# Altium schematic sheet LEDs.SchDoc
size A
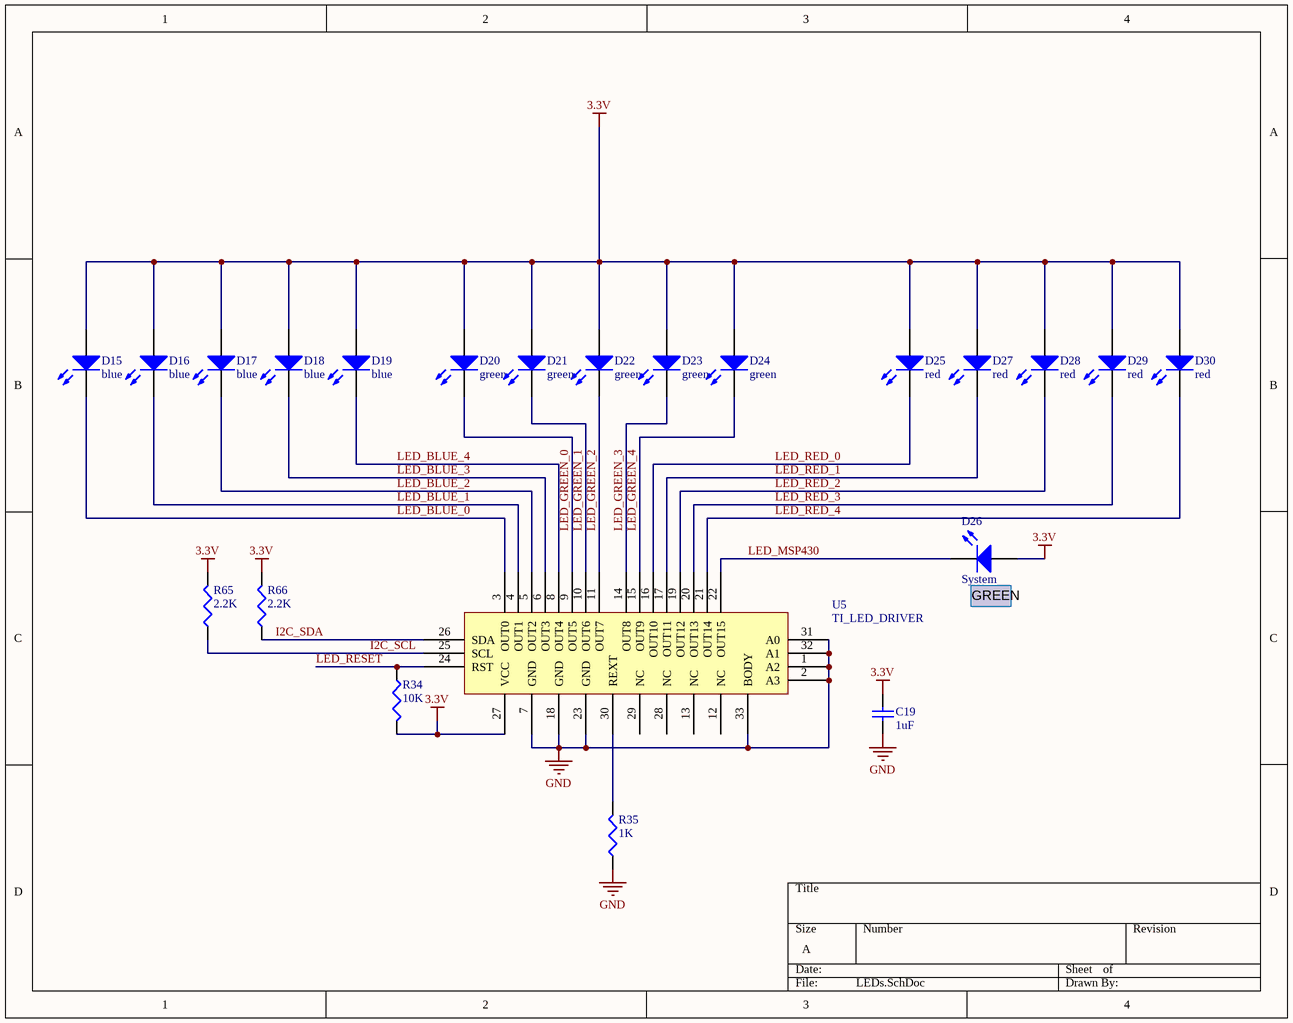
[diagram p0: LEDs.SchDoc]

## Parts
C19  value 1uF  [CAPC1608L]  (hidden comment: Cap Semi)
D15  blue  [SurfaceMount(603)]
D16  blue  [SurfaceMount(603)]
D17  blue  [SurfaceMount(603)]
D18  blue  [SurfaceMount(603)]
D19  blue  [SurfaceMount(603)]
D20  green  [SurfaceMount(603)]
D21  green  [SurfaceMount(603)]
D22  green  [SurfaceMount(603)]
D23  green  [SurfaceMount(603)]
D24  green  [SurfaceMount(603)]
D25  red  [SurfaceMount(603)]
D26  System  [SurfaceMount(603)]
D27  red  [SurfaceMount(603)]
D28  red  [SurfaceMount(603)]
D29  red  [SurfaceMount(603)]
D30  red  [SurfaceMount(603)]
R34  value 10K  [RESC1608L]  (hidden comment: Res3)
R35  value 1K  [RESC1608L]  (hidden comment: Res3)
R65  value 2.2K  [RESC1608L]  (hidden comment: Res3)
R66  value 2.2K  [RESC1608L]  (hidden comment: Res3)
U5  TI_LED_DRIVER  [QFN32-LEDTLC59116]

## Nets
3.3V: C19.2 D15.1(A) D16.1(A) D17.1(A) D18.1(A) D19.1(A) D20.1(A) D21.1(A) D22.1(A) D23.1(A) D24.1(A) D25.1(A) D26.1(A) D27.1(A) D28.1(A) D29.1(A) D30.1(A) R34.2 R65.2 R66.2 U5.27(VCC)
GND: C19.1 R35.1 U5.1(A2) U5.2(A3) U5.7(GND) U5.18(GND) U5.23(GND) U5.31(A0) U5.32(A1) U5.33(BODY)
I2C_SCL: R65.1 U5.25(SCL)
I2C_SDA: R66.1 U5.26(SDA)
LED_BLUE_0: D15.2(K) U5.3(OUT0)
LED_BLUE_1: D16.2(K) U5.4(OUT1)
LED_BLUE_2: D17.2(K) U5.5(OUT2)
LED_BLUE_3: D18.2(K) U5.6(OUT3)
LED_BLUE_4: D19.2(K) U5.8(OUT4)
LED_GREEN_0: D20.2(K) U5.9(OUT5)
LED_GREEN_1: D21.2(K) U5.10(OUT6)
LED_GREEN_2: D22.2(K) U5.11(OUT7)
LED_GREEN_3: D23.2(K) U5.14(OUT8)
LED_GREEN_4: D24.2(K) U5.15(OUT9)
LED_MSP430: D26.2(K) U5.22(OUT15)
LED_RED_0: D25.2(K) U5.16(OUT10)
LED_RED_1: D27.2(K) U5.17(OUT11)
LED_RED_2: D28.2(K) U5.19(OUT12)
LED_RED_3: D29.2(K) U5.20(OUT13)
LED_RED_4: D30.2(K) U5.21(OUT14)
LED_RESET: R34.1 U5.24(RST)
NetR35_2: R35.2 U5.30(REXT)

Not connected (* = marked no-connect by the designer): U5 12(NC) 13(NC) 28(NC) 29(NC)

## Notes on the sheet
- (near D26) GREEN

## Library data of the parts
C19 = Cap Semi: Capacitor (Semiconductor SIM Model); Part Number: C1608Y5V1C105Z; Manufacturer: TDK; Published: 8-Jun-2000; LatestRevisionDate: 29-May-2009; LatestRevisionNote: IPC-7351 Footprint Added.; PackageReference: C1206; Publisher: Altium Limited; PackageDescription: Chip Capacitor
D15-D19 = LED: Part Number: LB Q39G-L2N2-35-1; Manufacturer: Osram
D20-D24 D26 = LED: Part Number: LNJ612W8WRA; Manufacturer: Panasonic
D25 D27-D30 = LED: Part Number: LS Q976-NR-1; Manufacturer: Osram
R34 = Res3: Resistor; Part Number: SR03-1002; Manufacturer: Vishay; Published: 8-Jun-2000; LatestRevisionDate: 29-May-2009; LatestRevisionNote: IPC-7351 Footprint Added.; PackageReference: J1-0603; Publisher: Altium Limited; PackageDescription: Chip Resistor
R35 = Res3: Resistor; Part Number: SR03-1001; Manufacturer: Vishay; Published: 8-Jun-2000; LatestRevisionDate: 29-May-2009; LatestRevisionNote: IPC-7351 Footprint Added.; PackageReference: J1-0603; Publisher: Altium Limited; PackageDescription: Chip Resistor
R65 R66 = Res3: Resistor; Part Number: ERJ-3GEYJ-222V; Manufacturer: Panasonic; Published: 8-Jun-2000; LatestRevisionDate: 29-May-2009; LatestRevisionNote: IPC-7351 Footprint Added.; PackageReference: J1-0603; Publisher: Altium Limited; PackageDescription: Chip Resistor
U5 = TLC59116LEDDRIVER: Part Number: TLC59116IRHBR; Manufacturer: TI